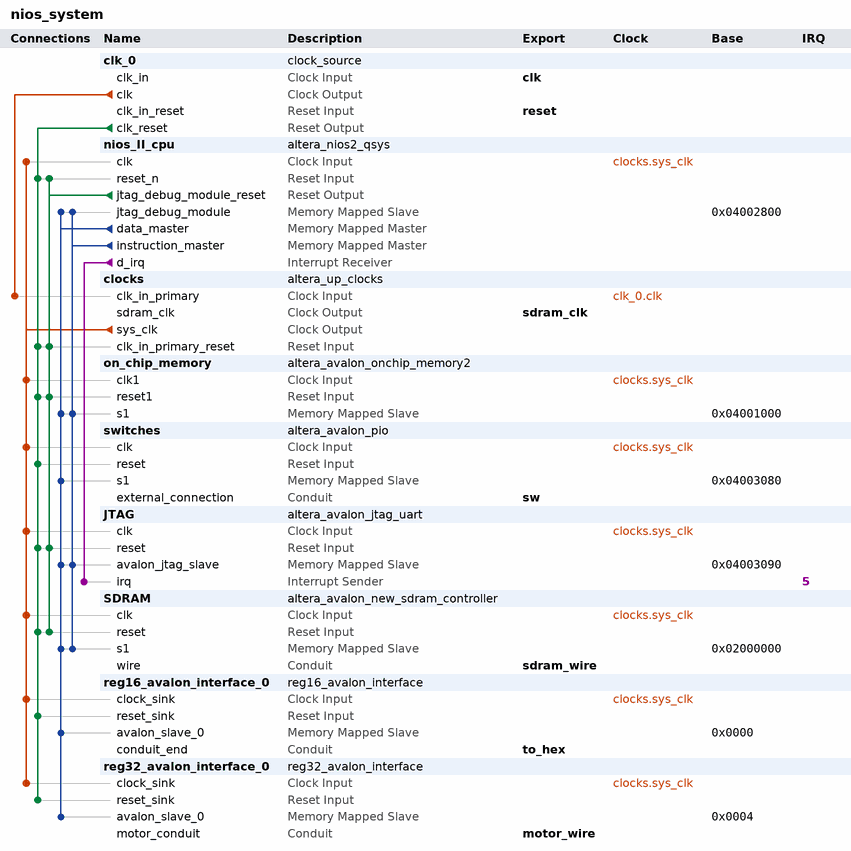
[diagram p0: system contents]
# Platform Designer (Qsys) system nios_system, Cyclone IV E EP4CE22F17C6
# Parameters at their usual value, and those the tool derives, are not listed.
package require -exact qsys 13.0.1.99.2
create_system nios_system
set_project_property DEVICE_FAMILY {Cyclone IV E}
set_project_property DEVICE EP4CE22F17C6

add_instance clk_0 clock_source 13.0
set_instance_parameter_value clk_0 clockFrequency 50000000

add_instance nios_II_cpu altera_nios2_qsys 13.0
set_instance_parameter_value nios_II_cpu resetSlave on_chip_memory.s1
set_instance_parameter_value nios_II_cpu mmu_TLBMissExcSlave None
set_instance_parameter_value nios_II_cpu exceptionSlave on_chip_memory.s1
set_instance_parameter_value nios_II_cpu breakSlave nios_II_cpu.jtag_debug_module
set_instance_parameter_value nios_II_cpu impl Tiny
set_instance_parameter_value nios_II_cpu icache_size 4096

add_instance clocks altera_up_clocks 13.0
set_instance_parameter_value clocks board DE2
set_instance_parameter_value clocks vga_clk false
set_instance_parameter_value clocks audio_clk false
set_instance_parameter_value clocks audio_clk_freq 12.288

add_instance on_chip_memory altera_avalon_onchip_memory2 13.0.1.99.2
set_instance_parameter_value on_chip_memory dataWidth 32
set_instance_parameter_value on_chip_memory dualPort false
set_instance_parameter_value on_chip_memory initMemContent true
set_instance_parameter_value on_chip_memory initializationFileName onchip_mem.hex
set_instance_parameter_value on_chip_memory memorySize 4096

add_instance switches altera_avalon_pio 13.0.1.99.2
set_instance_parameter_value switches direction Input
set_instance_parameter_value switches width 8

add_instance JTAG altera_avalon_jtag_uart 13.0.1.99.2
set_instance_parameter_value JTAG simInteractiveOptions NO_INTERACTIVE_WINDOWS

add_instance SDRAM altera_avalon_new_sdram_controller 13.0.1.99.2
set_instance_parameter_value SDRAM TAC 5.5
set_instance_parameter_value SDRAM TRCD 20.0
set_instance_parameter_value SDRAM TRP 20.0
set_instance_parameter_value SDRAM casLatency 3
set_instance_parameter_value SDRAM columnWidth 9
set_instance_parameter_value SDRAM dataWidth 16
set_instance_parameter_value SDRAM generateSimulationModel false
set_instance_parameter_value SDRAM model single_Micron_MT48LC4M32B2_7_chip
set_instance_parameter_value SDRAM numberOfBanks 4
set_instance_parameter_value SDRAM numberOfChipSelects 1
set_instance_parameter_value SDRAM powerUpDelay 100.0
set_instance_parameter_value SDRAM refreshPeriod 15.625
set_instance_parameter_value SDRAM rowWidth 13

add_instance reg16_avalon_interface_0 reg16_avalon_interface 1.0

add_instance reg32_avalon_interface_0 reg32_avalon_interface 1.0

# connections
add_connection clk_0.clk clocks.clk_in_primary clock
add_connection clocks.sys_clk JTAG.clk clock
add_connection clocks.sys_clk nios_II_cpu.clk clock
add_connection clocks.sys_clk on_chip_memory.clk1 clock
add_connection clocks.sys_clk reg16_avalon_interface_0.clock_sink clock
add_connection clocks.sys_clk reg32_avalon_interface_0.clock_sink clock
add_connection clocks.sys_clk SDRAM.clk clock
add_connection clocks.sys_clk switches.clk clock
add_connection clk_0.clk_reset clocks.clk_in_primary_reset reset
add_connection clk_0.clk_reset JTAG.reset reset
add_connection clk_0.clk_reset nios_II_cpu.reset_n reset
add_connection clk_0.clk_reset on_chip_memory.reset1 reset
add_connection clk_0.clk_reset reg16_avalon_interface_0.reset_sink reset
add_connection clk_0.clk_reset reg32_avalon_interface_0.reset_sink reset
add_connection clk_0.clk_reset SDRAM.reset reset
add_connection clk_0.clk_reset switches.reset reset
add_connection nios_II_cpu.jtag_debug_module_reset clocks.clk_in_primary_reset reset
add_connection nios_II_cpu.jtag_debug_module_reset JTAG.reset reset
add_connection nios_II_cpu.jtag_debug_module_reset nios_II_cpu.reset_n reset
add_connection nios_II_cpu.jtag_debug_module_reset on_chip_memory.reset1 reset
add_connection nios_II_cpu.jtag_debug_module_reset SDRAM.reset reset
add_connection nios_II_cpu.data_master JTAG.avalon_jtag_slave avalon
set_connection_parameter_value nios_II_cpu.data_master/JTAG.avalon_jtag_slave baseAddress 0x04003090
add_connection nios_II_cpu.data_master nios_II_cpu.jtag_debug_module avalon
set_connection_parameter_value nios_II_cpu.data_master/nios_II_cpu.jtag_debug_module baseAddress 0x04002800
add_connection nios_II_cpu.data_master on_chip_memory.s1 avalon
set_connection_parameter_value nios_II_cpu.data_master/on_chip_memory.s1 baseAddress 0x04001000
add_connection nios_II_cpu.data_master reg16_avalon_interface_0.avalon_slave_0 avalon
set_connection_parameter_value nios_II_cpu.data_master/reg16_avalon_interface_0.avalon_slave_0 baseAddress 0x0000
add_connection nios_II_cpu.data_master reg32_avalon_interface_0.avalon_slave_0 avalon
set_connection_parameter_value nios_II_cpu.data_master/reg32_avalon_interface_0.avalon_slave_0 baseAddress 0x0004
add_connection nios_II_cpu.data_master SDRAM.s1 avalon
set_connection_parameter_value nios_II_cpu.data_master/SDRAM.s1 baseAddress 0x02000000
add_connection nios_II_cpu.data_master switches.s1 avalon
set_connection_parameter_value nios_II_cpu.data_master/switches.s1 baseAddress 0x04003080
add_connection nios_II_cpu.instruction_master JTAG.avalon_jtag_slave avalon
set_connection_parameter_value nios_II_cpu.instruction_master/JTAG.avalon_jtag_slave baseAddress 0x04003090
add_connection nios_II_cpu.instruction_master nios_II_cpu.jtag_debug_module avalon
set_connection_parameter_value nios_II_cpu.instruction_master/nios_II_cpu.jtag_debug_module baseAddress 0x04002800
add_connection nios_II_cpu.instruction_master on_chip_memory.s1 avalon
set_connection_parameter_value nios_II_cpu.instruction_master/on_chip_memory.s1 baseAddress 0x04001000
add_connection nios_II_cpu.instruction_master SDRAM.s1 avalon
set_connection_parameter_value nios_II_cpu.instruction_master/SDRAM.s1 baseAddress 0x02000000
add_connection nios_II_cpu.d_irq JTAG.irq interrupt
set_connection_parameter_value nios_II_cpu.d_irq/JTAG.irq irqNumber 5

# exported interfaces
add_interface clk clock sink
set_interface_property clk EXPORT_OF clk_0.clk_in
add_interface reset reset sink
set_interface_property reset EXPORT_OF clk_0.clk_in_reset
add_interface sw conduit end
set_interface_property sw EXPORT_OF switches.external_connection
add_interface sdram_wire conduit end
set_interface_property sdram_wire EXPORT_OF SDRAM.wire
add_interface sdram_clk clock source
set_interface_property sdram_clk EXPORT_OF clocks.sdram_clk
add_interface to_hex conduit end
set_interface_property to_hex EXPORT_OF reg16_avalon_interface_0.conduit_end
add_interface motor_wire conduit end
set_interface_property motor_wire EXPORT_OF reg32_avalon_interface_0.motor_conduit

set_interconnect_requirement {$system} qsys_mm.clockCrossingAdapter HANDSHAKE
set_interconnect_requirement {$system} qsys_mm.maxAdditionalLatency 1

save_system nios_system.qsys
